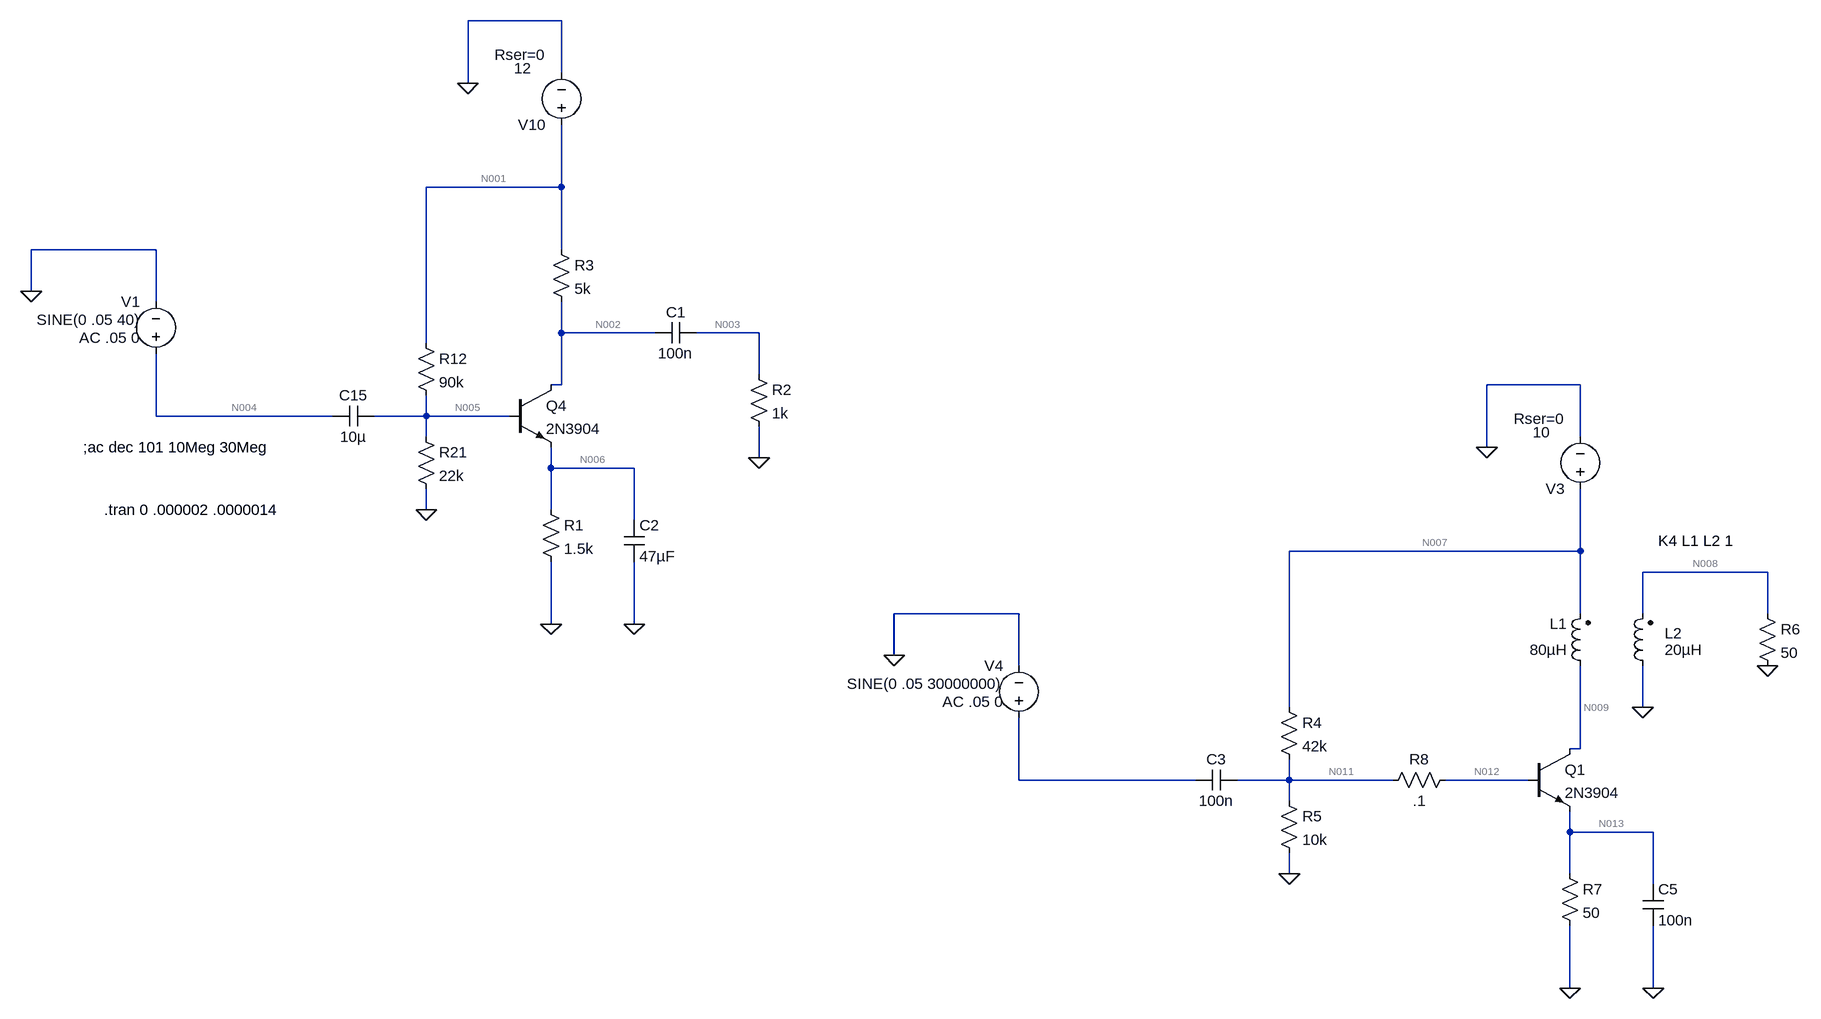
[diagram p0: schematic Transistor Impedance.asc]
Transistor Impedance.asc, the LTspice schematic file:
Version 4
SHEET 1 3764 1240
WIRE -1216 -6752 -1360 -6752
WIRE -1216 -6672 -1216 -6752
WIRE -1360 -6656 -1360 -6752
WIRE -1216 -6496 -1216 -6592
WIRE -1216 -6496 -1424 -6496
WIRE -1840 -6400 -2032 -6400
WIRE -1216 -6400 -1216 -6496
WIRE -2032 -6336 -2032 -6400
WIRE -1840 -6320 -1840 -6400
WIRE -1216 -6272 -1216 -6320
WIRE -1072 -6272 -1216 -6272
WIRE -912 -6272 -1008 -6272
WIRE -1424 -6256 -1424 -6496
WIRE -912 -6208 -912 -6272
WIRE -1216 -6192 -1216 -6272
WIRE -1216 -6192 -1232 -6192
WIRE 352 -6192 208 -6192
WIRE -1840 -6144 -1840 -6240
WIRE -1568 -6144 -1840 -6144
WIRE -1424 -6144 -1424 -6176
WIRE -1424 -6144 -1504 -6144
WIRE -1296 -6144 -1424 -6144
WIRE -1424 -6112 -1424 -6144
WIRE 352 -6112 352 -6192
WIRE 208 -6096 208 -6192
WIRE -912 -6080 -912 -6128
WIRE -1232 -6064 -1232 -6096
WIRE -1104 -6064 -1232 -6064
WIRE -1424 -6000 -1424 -6032
WIRE -1232 -6000 -1232 -6064
WIRE -1104 -5984 -1104 -6064
WIRE 352 -5936 352 -6032
WIRE 352 -5936 -96 -5936
WIRE 640 -5904 448 -5904
WIRE -512 -5840 -704 -5840
WIRE 352 -5840 352 -5936
WIRE 448 -5840 448 -5904
WIRE 640 -5840 640 -5904
WIRE -1232 -5824 -1232 -5920
WIRE -1104 -5824 -1104 -5920
WIRE -704 -5776 -704 -5840
WIRE -512 -5760 -512 -5840
WIRE -96 -5696 -96 -5936
WIRE 448 -5696 448 -5760
WIRE 352 -5632 352 -5760
WIRE 352 -5632 336 -5632
WIRE -512 -5584 -512 -5680
WIRE -240 -5584 -512 -5584
WIRE -96 -5584 -96 -5616
WIRE -96 -5584 -176 -5584
WIRE 64 -5584 -96 -5584
WIRE 272 -5584 144 -5584
WIRE -96 -5552 -96 -5584
WIRE 336 -5504 336 -5536
WIRE 464 -5504 336 -5504
WIRE -96 -5440 -96 -5472
WIRE 336 -5440 336 -5504
WIRE 464 -5424 464 -5504
WIRE 336 -5264 336 -5360
WIRE 464 -5264 464 -5360
FLAG -1424 -6000 0
FLAG -1232 -5824 0
FLAG -1360 -6656 0
FLAG -2032 -6336 0
FLAG -912 -6080 0
FLAG -1104 -5824 0
FLAG 448 -5696 0
FLAG -96 -5440 0
FLAG 336 -5264 0
FLAG 208 -6096 0
FLAG -704 -5776 0
FLAG 464 -5264 0
FLAG 640 -5760 0
SYMBOL npn -1296 -6192 R0
SYMATTR InstName Q4
SYMATTR Value 2N3904
SYMBOL cap -1504 -6160 R90
WINDOW 0 0 32 VBottom 2
WINDOW 3 32 32 VTop 2
SYMATTR InstName C15
SYMATTR Value 10µ
SYMBOL res -1440 -6272 R0
SYMATTR InstName R12
SYMATTR Value 90k
SYMBOL res -1440 -6128 R0
SYMATTR InstName R21
SYMATTR Value 22k
SYMBOL voltage -1216 -6576 R180
WINDOW 123 0 0 Left 0
WINDOW 39 24 124 Left 2
WINDOW 3 46 103 Left 2
SYMATTR SpiceLine Rser=0
SYMATTR Value 12
SYMATTR InstName V10
SYMBOL res -1232 -6416 R0
SYMATTR InstName R3
SYMATTR Value 5k
SYMBOL res -1248 -6016 R0
SYMATTR InstName R1
SYMATTR Value 1.5k
SYMBOL voltage -1840 -6224 R180
WINDOW 0 24 96 Left 2
WINDOW 3 24 68 Left 2
WINDOW 123 24 40 Left 2
WINDOW 39 0 0 Left 0
SYMATTR InstName V1
SYMATTR Value SINE(0 .05 40)
SYMATTR Value2 AC .05 0
SYMBOL cap -1008 -6288 R90
WINDOW 0 0 32 VBottom 2
WINDOW 3 32 32 VTop 2
SYMATTR InstName C1
SYMATTR Value 100n
SYMBOL res -928 -6224 R0
SYMATTR InstName R2
SYMATTR Value 1k
SYMBOL cap -1120 -5984 R0
SYMATTR InstName C2
SYMATTR Value 47µF
SYMBOL ind2 368 -5744 R180
WINDOW 0 36 80 Left 2
WINDOW 3 36 40 Left 2
SYMATTR InstName L1
SYMATTR Value 80µH
SYMATTR Type ind
SYMBOL ind2 464 -5744 R180
WINDOW 0 -45 66 Left 2
WINDOW 3 -76 40 Left 2
SYMATTR InstName L2
SYMATTR Value 20µH
SYMATTR Type ind
SYMBOL npn 272 -5632 R0
SYMATTR InstName Q1
SYMATTR Value 2N3904
SYMBOL cap -176 -5600 R90
WINDOW 0 0 32 VBottom 2
WINDOW 3 32 32 VTop 2
SYMATTR InstName C3
SYMATTR Value 100n
SYMBOL res -112 -5712 R0
SYMATTR InstName R4
SYMATTR Value 42k
SYMBOL res -112 -5568 R0
SYMATTR InstName R5
SYMATTR Value 10k
SYMBOL voltage 352 -6016 R180
WINDOW 123 0 0 Left 0
WINDOW 39 24 124 Left 2
WINDOW 3 46 103 Left 2
SYMATTR SpiceLine Rser=0
SYMATTR Value 10
SYMATTR InstName V3
SYMBOL res 320 -5456 R0
SYMATTR InstName R7
SYMATTR Value 50
SYMBOL voltage -512 -5664 R180
WINDOW 0 24 96 Left 2
WINDOW 3 24 68 Left 2
WINDOW 123 24 40 Left 2
WINDOW 39 0 0 Left 0
SYMATTR InstName V4
SYMATTR Value SINE(0 .05 30000000)
SYMATTR Value2 AC .05 0
SYMBOL cap 448 -5424 R0
SYMATTR InstName C5
SYMATTR Value 100n
SYMBOL res 624 -5856 R0
SYMATTR InstName R6
SYMATTR Value 50
SYMBOL res 160 -5600 R90
WINDOW 0 0 56 VBottom 2
WINDOW 3 32 56 VTop 2
SYMATTR InstName R8
SYMATTR Value .1
TEXT -1952 -6096 Left 2 !;ac dec 101 10Meg 30Meg
TEXT -1920 -6000 Left 2 !.tran 0 .000002 .0000014
TEXT 472 -5952 Left 2 !K4 L1 L2 1

The netlist it stands for:
* Transistor Impedance.asc
Q4 N002 N005 N006 0 2N3904
C15 N005 N004 10µ
R12 N001 N005 90k
R21 N005 0 22k
V10 N001 0 12 Rser=0
R3 N001 N002 5k
R1 N006 0 1.5k
V1 N004 0 SINE(0 .05 40) AC .05 0
C1 N003 N002 100n
R2 N003 0 1k
C2 N006 0 47µF
L1 N009 N007 80µH
L2 0 N008 20µH
Q1 N009 N012 N013 0 2N3904
C3 N011 N010 100n
R4 N007 N011 42k
R5 N011 0 10k
V3 N007 0 10 Rser=0
R7 N013 0 50
V4 N010 0 SINE(0 .05 30000000) AC .05 0
C5 N013 0 100n
R6 N008 0 50
R8 N012 N011 .1
.model NPN NPN
.model PNP PNP
.lib standard.bjt
;ac dec 101 10Meg 30Meg
.tran 0 .000002 .0000014
K4 L1 L2 1
.backanno
.end

* Results of the author's LTspice run, read from the files saved beside the schematic
* Operating Point, zero values left out:
*   V(n002) = 6.554 V
*   V(n005) = 2.295 V
*   V(n006) = 1.639 V
*   V(n001) = 12 V
*   V(n009) = 10 V
*   V(n007) = 10 V
*   V(n012) = 1.518 V
*   V(n013) = 790.1 mV
*   V(n011) = 1.518 V
*   Ic(Q1) = 15.75 mA
*   Ib(Q1) = 50.16 µA
*   Ie(Q1) = -15.8 mA
*   Ic(Q4) = 1.089 mA
*   Ib(Q4) = 3.491 µA
*   Ie(Q4) = -1.093 mA
*   I(L1) = -15.75 mA
*   I(R8) = -50.16 µA
*   I(R7) = 15.8 mA
*   I(R5) = 151.8 µA
*   I(R4) = 202 µA
*   I(R1) = 1.093 mA
*   I(R3) = 1.089 mA
*   I(R21) = 104.3 µA
*   I(R12) = 107.8 µA
*   I(V3) = -15.95 mA
*   I(V10) = -1.197 mA
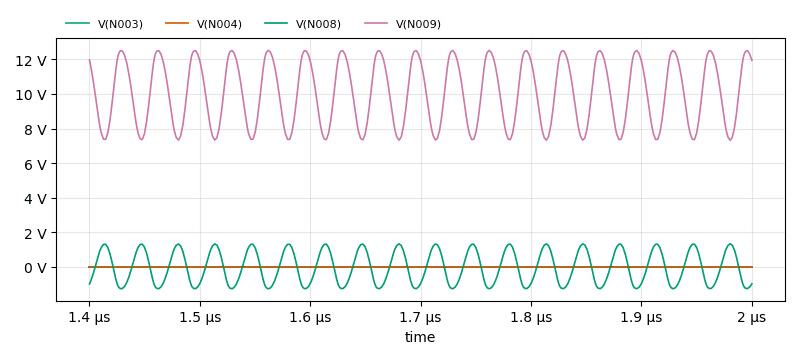
[diagram p1: Transient Analysis of Transistor Impedance.asc, plotted from the saved traces]
* Transient Analysis, 1 run:
*   V(N003): min -2.178 mV, max -1.921 mV, average -2.05 mV, rms 2.051 mV, last -2.178 mV
*   V(N004): min 17.59 µV, max 25.13 µV, average 21.36 µV, rms 21.47 µV, last 25.13 µV
*   V(N008): min -1.26 V, max 1.339 V, average -7.751 mV, rms 929.7 mV, last -973 mV
*   V(N009): min 7.323 V, max 12.52 V, average 10.02 V, rms 10.19 V, last 11.95 V